# Altium schematic sheet CPU_NEW.SchDoc
size A3; Organization: Altium Limited; Address1: L3, 12a Rodborough Rd; Address2: Frenchs Forest; Address3: NSW; Address4: Australia 2086; PageSetup: Record=PageOptions|CenterHorizontal=True|CenterVertical=True|PrintScale=1.01|XCorrection=1.00|YCorrection=1.00|PrintKind=1|BorderSize=5000000|LeftOffset=0|BottomOffset=0|Orientation=2|PaperLength=1000|PaperWidth=1000|Scale=100|PaperSource=7|PrintQuality=300|MediaType=1|DitherType=10|PrintScaleMode=1|PaperKind=A3 (297x420mm)|PaperIndex=8
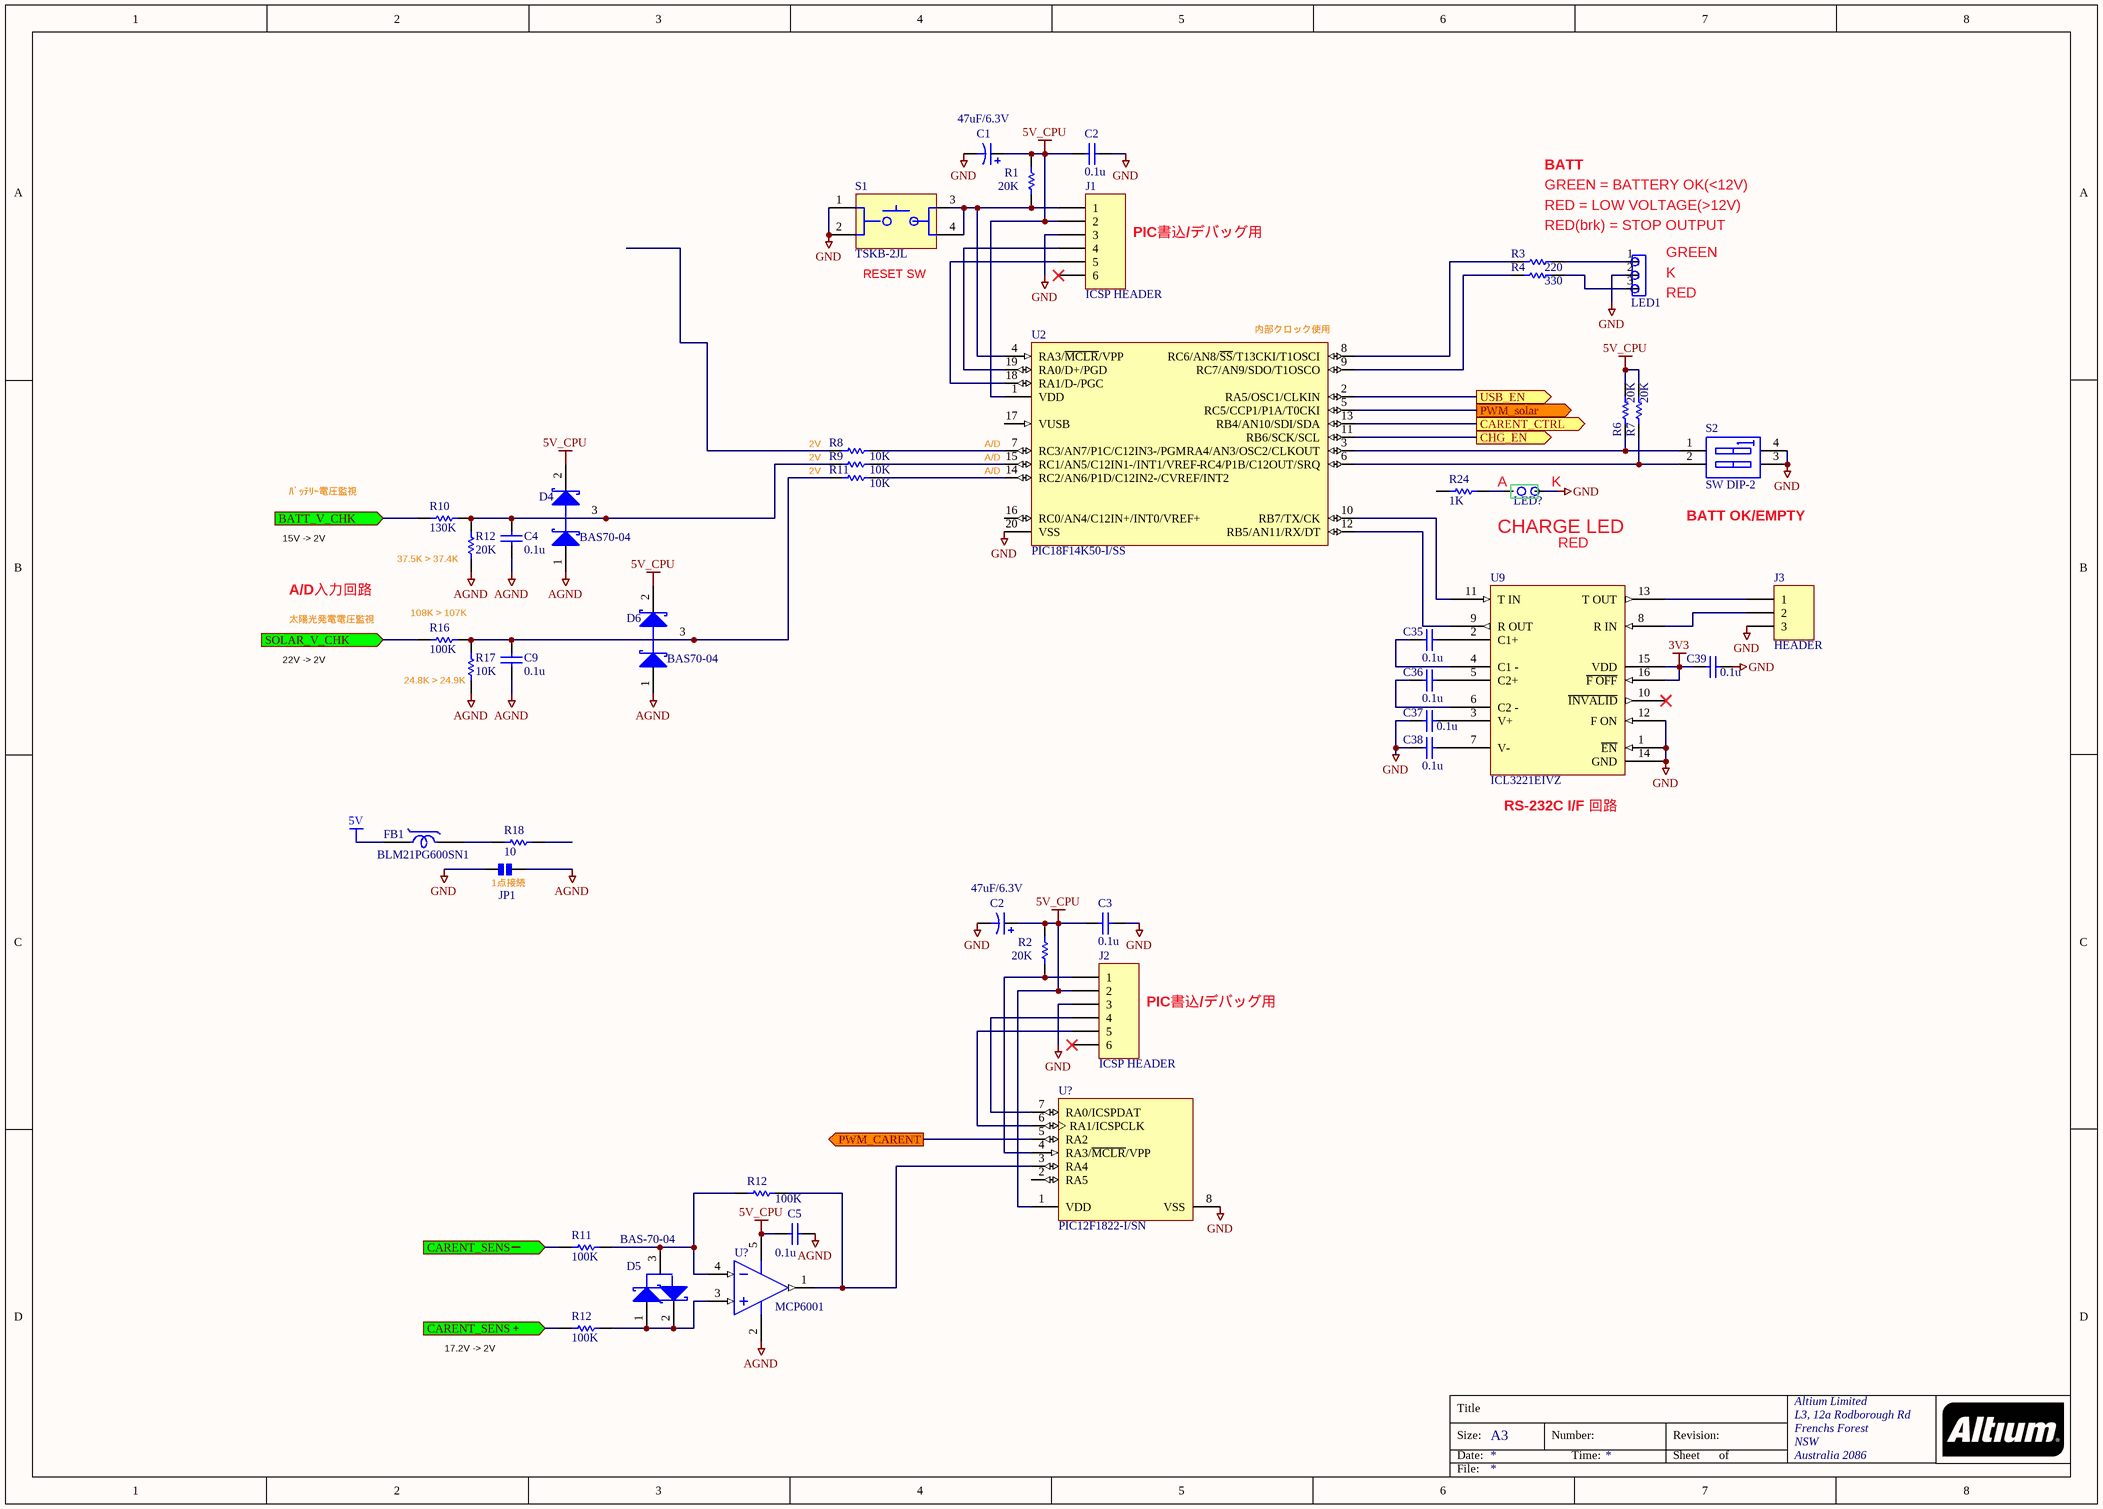
[diagram p0: CPU_NEW.SchDoc]

## Parts
(Parts that share a designator on the sheet are numbered #1, #2 ... from top to bottom, then left to right.)
C1  47uF/6.3V  [CAPC4532L]
C2#1  0.1u  [CAPC1608L]
C2#2  47uF/6.3V  [CAPC4532L]
C3  0.1u  [CAPC1608L]
C4  0.1u  [CAPC1608L]
C5  0.1u  [CAPC1608L]
C9  0.1u  [CAPC1608L]
C35  0.1u  [CAPC1608L]
C36  0.1u  [CAPC1608L]
C37  0.1u  [CAPC1608L]
C38  0.1u  [CAPC1608L]
C39  0.1u  [CAPC1608L]
D4  BAS70-04  [SOT-23]
D5  BAS-70-04
D6  BAS70-04  [SOT-23]
FB1  value BLM21PG600SN1  [INDC2012L]  (hidden comment: FERRITE BEADS1)
J1  ICSP HEADER  [HDR1X6]
J2  ICSP HEADER  [HDR1X6]
J3  HEADER  [HDR1X3]
JP1  JP4  (value not drawn)
LED1  JP3_1  (value not drawn)
LED?  JP1  (value not drawn)
R1  20K  [AXIAL-0.5]
R2  20K  [AXIAL-0.5]
R3  220  [AXIAL-0.3]
R4  330  [AXIAL-0.3]
R6  20K  [AXIAL-0.5]
R7  20K  [AXIAL-0.5]
R8  10K  [AXIAL-0.5]
R9  10K  [AXIAL-0.5]
R10  130K  [AXIAL-0.5]
R11#1  10K  [AXIAL-0.5]
R11#2  100K  [AXIAL-0.5]
R12#1  20K  [AXIAL-0.5]
R12#2  100K  [AXIAL-0.5]
R12#3  100K  [AXIAL-0.5]
R16  100K  [AXIAL-0.5]
R17  10K  [AXIAL-0.5]
R18  10  [AXIAL-0.5]
R24  1K  [AXIAL-0.3]
S1  TSKB-2JL
S2  SW DIP-2  [DIP-4]
U2  PIC18F14K50-I/SS  [MCHP-SSOP-SS20_N]
U9  ICL3221EIVZ
U?#1  PIC12F1822-I/SN  [MCHP-SOIC-SN8_N]
U?#2  MCP6001

## Ports
BATT_V_CHK (in), CARENT_CTRL (out), CARENT_SENSー (in), CARENT_SENS＋ (in), CHG_EN (out), PWM_CARENT (out), PWM_solar (out), SOLAR_V_CHK (in), USB_EN (out)

## Nets
3V3: C39.1 U9.15(VDD) U9.16(~{F_OFF})
5V: FB1.1
5V_CPU: C1.1 C2#1.2 C2#2.1 C3.2 C5.1 D4.2(K) D6.2(K) J1.2 J2.2 R1.2 R2.2 R6.2 R7.2 U2.1(VDD) U?#1.1(VDD) U?#2.5(VDD)
AGND: C4.2 C5.2 C9.2 D4.1(A) D6.1(A) JP1.2 R12#1.1 R17.1 U?#2.2(VSS)
GND: C1.2 C2#1.1 C2#2.2 C3.1 C37.1 C38.1 C39.2 J1.3 J2.3 J3.3 JP1.1 LED1.2 LED?.2 S1.1 S1.2 S2.3(B2) S2.4(B1) U2.20(VSS) U9.1(~{EN}) U9.12(F_ON) U9.14(GND) U?#1.8(VSS)
BATT_V_CHK: R10.2 ; port BATT_V_CHK
CARENT_CTRL: U2.13(RB4/AN10/SDI/SDA) ; port CARENT_CTRL
CARENT_SENSー: R11#2.2 ; port CARENT_SENSー
CARENT_SENS＋: R12#3.2 ; port CARENT_SENS＋
CHG_EN: U2.11(RB6/SCK/SCL) ; port CHG_EN
PWM_CARENT: U?#1.5(RA2) ; port PWM_CARENT
PWM_solar: U2.5(RC5/CCP1/P1A/T0CKI) ; port PWM_solar
SOLAR_V_CHK: R16.2 ; port SOLAR_V_CHK
USB_EN: U2.2(RA5/OSC1/CLKIN) ; port USB_EN
NetC4_1: C4.1 D4.3(C) R9.2 R10.1 R12#1.2
NetC9_1: C9.1 D6.3(C) R11#1.2 R16.1 R17.2
NetC35_1: C35.1 U9.4(C1_-)
NetC35_2: C35.2 U9.2(C1+)
NetC36_1: C36.1 U9.6(C2_-)
NetC36_2: C36.2 U9.5(C2+)
NetC37_2: C37.2 U9.3(V+)
NetC38_2: C38.2 U9.7(V-)
NetD5_1: D5.1(A) D5.2(K) R12#3.1 U?#2.3(VIN+)
NetD5_3: D5.3(C) R11#2.1 R12#2.2 U?#2.4(VIN-)
NetFB1_2: FB1.2 R18.2
NetJ1_1: J1.1 R1.1 S1.3 S1.4 U2.4(RA3/~{MCLR}/VPP)
NetJ1_4: J1.4 U2.19(RA0/D+/PGD)
NetJ1_5: J1.5 U2.18(RA1/D-/PGC)
NetJ2_1: J2.1 R2.1 U?#1.4(RA3/~{MCLR}/VPP)
NetJ2_4: J2.4 U?#1.7(RA0/ICSPDAT)
NetJ2_5: J2.5 U?#1.6(RA1/ICSPCLK)
NetJ3_1: J3.1 U9.13(T_OUT)
NetJ3_2: J3.2 U9.8(R_IN)
NetLED1_1: LED1.1 R3.2
NetLED1_3: LED1.3 R4.2
NetLED?_1: LED?.1 R24.2
NetR3_1: R3.1 U2.8(RC6/AN8/~{SS}/T13CKI/T1OSCI)
NetR4_1: R4.1 U2.9(RC7/AN9/SDO/T1OSCO)
NetR6_1: R6.1 S2.1(A1) U2.3(RA4/AN3/OSC2/CLKOUT)
NetR7_1: R7.1 S2.2(A2) U2.6(RC4/P1B/C12OUT/SRQ)
NetR8_1: R8.1 U2.7(RC3/AN7/P1C/C12IN3-/PGM)
NetR9_1: R9.1 U2.15(RC1/AN5/C12IN1-/INT1/VREF-)
NetR11#1_1: R11#1.1 U2.14(RC2/AN6/P1D/C12IN2-/CVREF/INT2)
NetR12#2_1: R12#2.1 U?#1.3(RA4) U?#2.1(VOUT)
NetU2_10: U2.10(RB7/TX/CK) U9.11(T_IN)
NetU2_12: U2.12(RB5/AN11/RX/DT) U9.9(R_OUT)

Not connected (* = marked no-connect by the designer): J1 6*; J2 6*; R8 2; R18 1; R24 1; U2 16(RC0/AN4/C12IN+/INT0/VREF+) 17(VUSB); U9 10(~{INVALID})*; U?#1 2(RA5)

## Notes on the sheet
- BATT
- (near J1) PIC書込/デバッグ用
- GREEN = BATTERY OK(<12V)
- RED(brk) = STOP OUTPUT
- RED = LOW VOLTAGE(>12V)
- (near S1) RESET SW
- (near LED1) RED
- (near LED1) GREEN
- (near LED1) K
- (near U2) 内部クロック使用
- 2V
- (near U2) A/D
- ﾊﾞｯﾃﾘｰ電圧監視
- (near LED?) A
- (near LED?) K
- 15V -> 2V
- (near R12#1) 37.5K > 37.4K
- CHARGE LED
- RED
- (near S2) BATT OK/EMPTY
- 太陽光発電電圧監視
- A/D入力回路
- (near R16) 108K > 107K
- 22V -> 2V
- (near R17) 24.8K > 24.9K
- (near U9) RS-232C I/F 回路
- (near JP1) 1点接続
- (near J2) PIC書込/デバッグ用
- 17.2V -> 2V
- Title
- Size:
- Date:
- A3
- Number:
- Time:
- Revision:
- Sheet
- of
- File:

## Library data of the parts
C1 C2#2 = Cap Pol3: Polarized Capacitor (Surface Mount); Published: 8-Jun-2000; LatestRevisionDate: 29-May-2009; LatestRevisionNote: IPC-7351 Footprint Added.; PackageReference: C0805; Publisher: Altium Limited; PackageDescription: Chip Capacitor; Value: 47uF/6.3V
C2#1 C3-C5 C9 C35-C39 = Cap Semi: Capacitor (Semiconductor SIM Model); Published: 8-Jun-2000; LatestRevisionDate: 29-May-2009; LatestRevisionNote: IPC-7351 Footprint Added.; PackageReference: C1206; Publisher: Altium Limited; PackageDescription: Chip Capacitor; Value: 0.1u
D4 D6 = BAS70-04: Silicon AF Schottky Diode for High-Speed Switching; Published: 21-Mar-2003; DatasheetDocument: Oct-1999; PackageDocument: Sep-2001; PackageReference: SOT-23; Publisher: Altium Limited; ComponentLink1Description: Manufacturer Link; ComponentLink1URL: http://www.infineon.com/
D5 = BAS-70-04-1
J1 J2 = Header 6: Header, 6-Pin; LatestRevisionDate: 17-Jul-2002; LatestRevisionNote: Re-released for DXP Platform.; Publisher: Altium Limited
J3 = Header 3: Header, 3-Pin; LatestRevisionDate: 17-Jul-2002; LatestRevisionNote: Re-released for DXP Platform.; Publisher: Altium Limited
R1 R2 R6-R10 R11#1 R11#2 R12#1-R12#3 R16-R18 = Res Semi: Semiconductor Resistor; Published: 8-Jun-2000; LatestRevisionDate: 17-Jul-2002; LatestRevisionNote: Re-released for DXP Platform.; PackageReference: AXIAL-0.5; Publisher: Altium Limited
  R1 R2 R6 R7 R12#1: Value: 20K
  R8 R9 R11#1 R17: Value: 10K
  R10: Value: 130K
  R11#2 R12#2 R12#3 R16: Value: 100K
  R18: Value: 10
R3 R4 R24 = Res1: Resistor; PARTS: AH-50W 10R; PRICE: 350; LatestRevisionDate: 17-Jul-2002; LatestRevisionNote: Re-released for DXP Platform.; PackageReference: AXIAL-0.3
  R3: Value: 220
  R4: Value: 330
  R24: Value: 1K
S1 = SW-1
S2 = SW DIP-2: DIP Switch, 2 Position, SPST; Published: 24-Mar-1999; LatestRevisionDate: 17-Jul-2002; LatestRevisionNote: Re-released for DXP Platform.; PackageReference: DIP-4; Publisher: Altium Limited
U2 = PIC18F14K50-I/SS: USB Flash Microcontroller with nanoWatt XLP Technology, 20-pin SSOP, Industrial Temperature; Manufacturer: Microchip; DatasheetVersion: revC, Mar-2009; PackageVersion: C04-072B, 12/2012; PackageReference: SSOP-SS20; PackageDescription: 20-Lead Plastic Shrink Small Outline, 5.3 x 7.2 mm Body, 0.65 mm Pitch; PartNumber: PIC18F14K50-I/SS; ComponentLink1Description: Manufacturer URL; ComponentLink1URL: http://www.microchip.com/; ComponentLink2Description: Datasheet; ComponentLink2URL: http://ww1.microchip.com/downloads/en/DeviceDoc/41350C.pdf; ComponentLink3Description: Package Specification; ComponentLink3URL: http://www.microchip.com/stellent/groups/techpub_sg/documents/packagingspec/en012702.pdf
U9 = TRS3221E
U?#1 = PIC12F1822-I/SN: Flash Microcontroller with XLP Technology, 32 MHz, 5 I/O, -40 to 85 degC, 8-pin SOIC (SN8), Tube; Manufacturer: Microchip; # of A/D Channels: 4; Digital Communication: 1 -A/E/USART, 1 -MSSP(SPI/I2C); EEPROM Data Memory (bytes): 256; I/O Pins: 5; Internal Oscillator: 32 MHz, 31 kHz; Max. CPU Speed MHz: 32; Operation Voltage Range: 1.8V - 5.5V; Program Memory KBytes: 3.5; Program Memory KWords: 2; RAM: 128; Timers: 2 - 8-bit, 1 - 16-bit, 0 - 32-bit; DatasheetVersion: Rev. C; PackageVersion: C04-057C, 12/2012; PackageReference: SOIC-SN8; PackageDescription: 8-Lead Plastic Small Outline, 4.9 x 3.9 mm Body, 1.27 mm Pitch; Supplier 1: Digi-Key; Supplier Part Number 1: PIC12F1822-I/SN-ND; Supplier 2: Farnell; Supplier Part Number 2: 1971857; Supplier 3: Newark; Supplier Part Number 3: 53R0197; Supplier 4: Mouser; Supplier Part Number 4: 579-PIC12F1822-I/SN; Memory Type: Flash; Packing: TUBE; RoHS: TRUE; Mounting Technology: Surface Mount; PartNumber: PIC12F1822-I/SN; ComponentLink1Description: Datasheet; ComponentLink1URL: http://ww1.microchip.com/downloads/en/DeviceDoc/41413C.pdf; ComponentLink2Description: Package Specification; ComponentLink2URL: http://www.microchip.com/stellent/groups/techpub_sg/documents/packagingspec/en012702.pdf; ComponentLink3Description: URL Link1; ComponentLink3URL: Product URL:http://www.microchip.com/datasheet/PIC12F1822